# EAGLE design MAX30101_Qwiic_PCB (EAGLE 9.6.2)
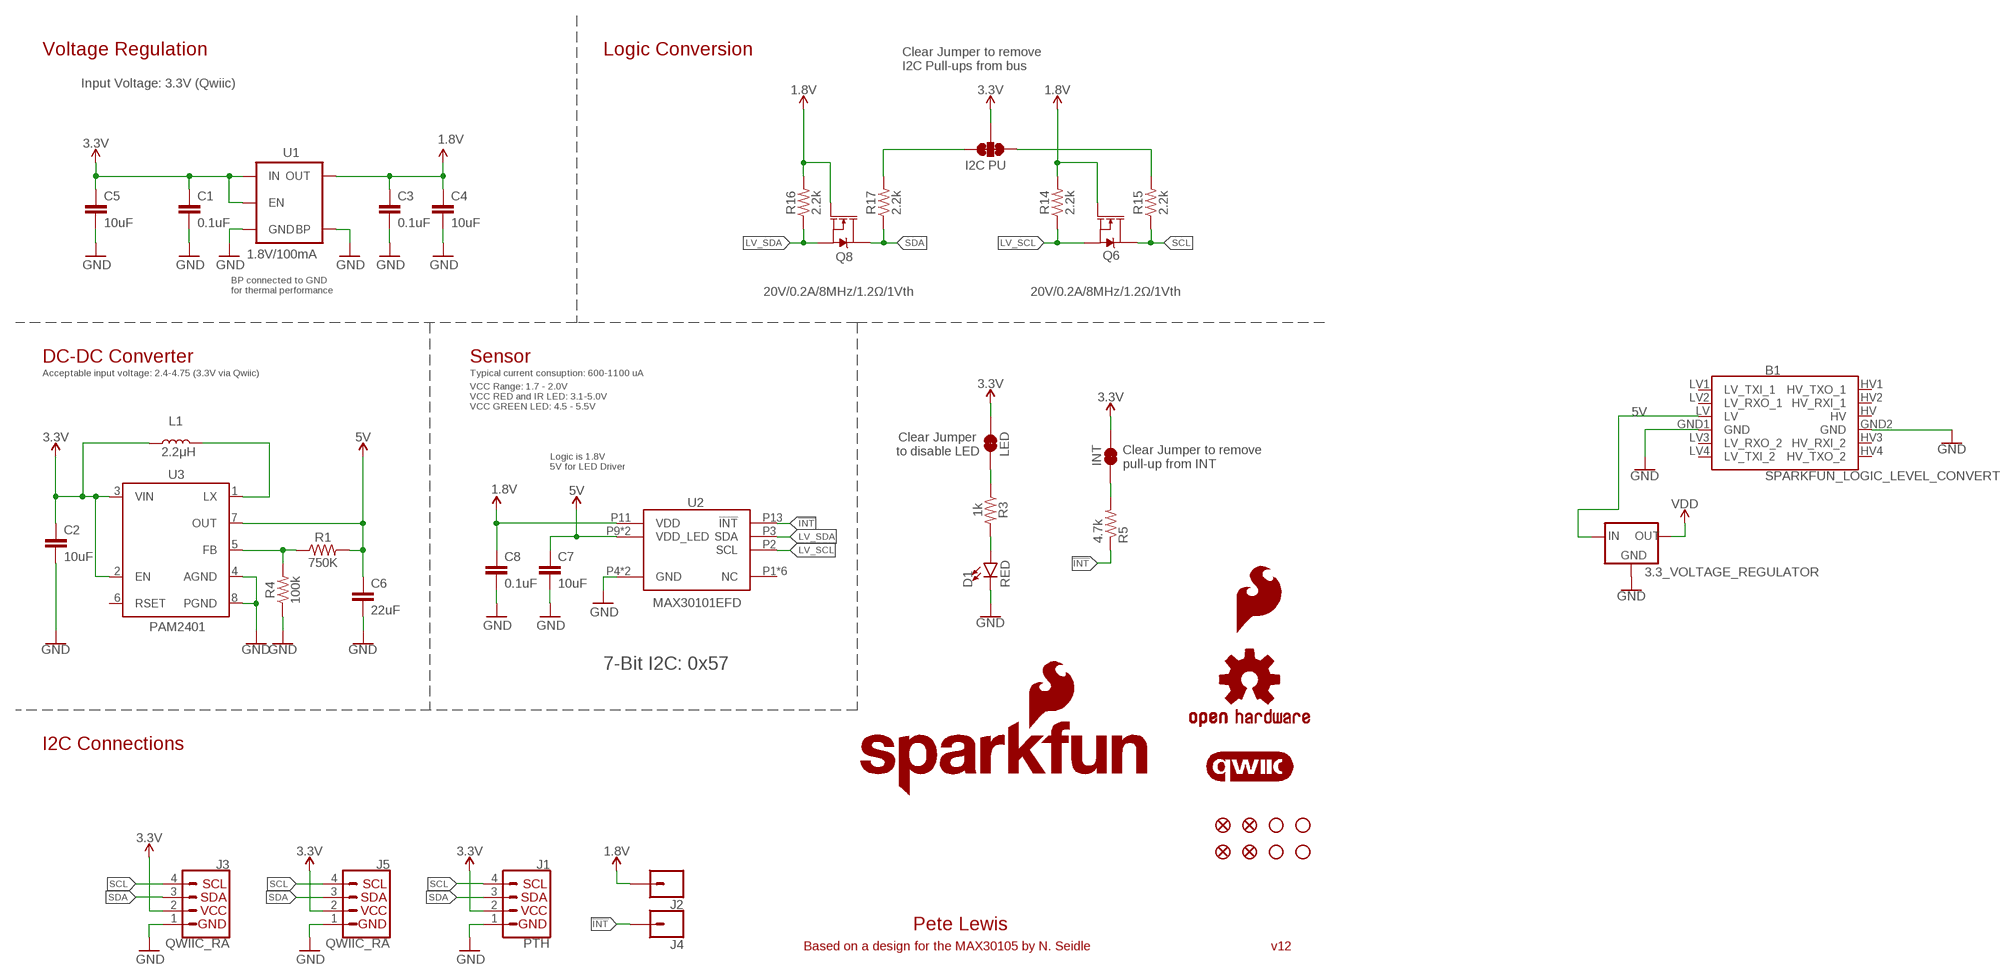
[diagram p0: schematic, sheet 1]

## Parts
3.3_VOLTAGE_REGULATOR  V_REG_78XX-TO-220  [TO-220-ALT]
B1  SPARKFUN_LOGIC_LEVEL_CONVERTER  [SPARKFUN_LOGIC_LEVEL_CONVERTER]
C1  0.1uF  0.1UF-0402-16V-10%  [0402]
C2  10uF  10UF-0603-6.3V-20%  [0603]
C3  0.1uF  0.1UF-0402-16V-10%  [0402]
C4  10uF  10UF-0603-6.3V-20%  [0603]
C5  10uF  10UF-0603-6.3V-20%  [0603]
C6  22uF  22UF-0805-6.3V-20%  [0805]
C7  10uF  10UF-0603-6.3V-20%  [0603]
C8  0.1uF  0.1UF-0402-16V-10%  [0402]
D1  RED  LED-RED0603  [LED-0603]
FID1  FIDUCIAL1X2  [FIDUCIAL-1X2]
FID2  FIDUCIAL1X2  [FIDUCIAL-1X2]
FID3  FIDUCIAL1X2  [FIDUCIAL-1X2]
FID4  FIDUCIAL1X2  [FIDUCIAL-1X2]
J1  PTH  I2C_STANDARD_NO_SILK  [1X04_NO_SILK]
J2  CONN_01PTH_NO_SILK_YES_STOP  [1X01_NO_SILK]
J3  QWIIC_RA  QWIIC_CONNECTORJS-1MM  [JST04_1MM_RA]
J4  CONN_01PTH_NO_SILK_YES_STOP  [1X01_NO_SILK]
J5  QWIIC_RA  QWIIC_CONNECTORJS-1MM  [JST04_1MM_RA]
JP1  LED  JUMPER-SMT_2_NC_TRACE_SILK  [SMT-JUMPER_2_NC_TRACE_SILK]
JP2  INT  JUMPER-SMT_2_NC_TRACE_SILK  [SMT-JUMPER_2_NC_TRACE_SILK]
JP4  I2C PU  JUMPER-SMT_3_2-NC_TRACE_SILK  [SMT-JUMPER_3_2-NC_TRACE_SILK]
L1  2.2μH  2.2μH_SHIELDED_INDUCTOR  [0806]
LOGO1  SFE_LOGO_NAME_FLAME.1_INCH  [SFE_LOGO_NAME_FLAME_.1]
LOGO2  OSHW-LOGOS  [OSHW-LOGO-S]
LOGO3  QWIIC_LOGO_5MM  [QWIIC_5MM]
LOGO4  SFE_LOGO_FLAME.1_INCH  [SFE_LOGO_FLAME_.1]
Q6  20V/0.2A/8MHz/1.2Ω/1Vth  MOSFET-NCH-RE1C00UNTL  [SOT-416FL]
Q8  20V/0.2A/8MHz/1.2Ω/1Vth  MOSFET-NCH-RE1C00UNTL  [SOT-416FL]
R1  750K  750KOHM-0603-1/10W-1%  [0603]
R3  1k  1KOHM-0603-1/10W-1%  [0603]
R4  100k  100KOHM-0603-1/10W-1%  [0603]
R5  4.7k  4.7KOHM-0603-1/10W-1%  [0603]
R14  2.2k  2.2KOHM-0603-1/10W-1%  [0603]
R15  2.2k  2.2KOHM-0603-1/10W-1%  [0603]
R16  2.2k  2.2KOHM-0603-1/10W-1%  [0603]
R17  2.2k  2.2KOHM-0603-1/10W-1%  [0603]
STANDOFF1  STAND-OFF  [STAND-OFF]
STANDOFF2  STAND-OFF  [STAND-OFF]
STANDOFF3  STAND-OFF  [STAND-OFF]
STANDOFF4  STAND-OFF  [STAND-OFF]
U1  1.8V/100mA  V_REG_SP62141.8V  [SC70]
U2  MAX30101EFD  [14_PIN_OESIP]
U3  PAM2401  [MSOP8]

## Nets
1.8V: C3.1 C4.1 C8.1 J2.1 Q6.1(G) Q8.1(G) R14.2 R16.2 U1.5(OUT) U2.P11(VDD)
3.3V: C1.1 C2.1 C5.1 J1.2 J3.2 J5.2 JP1.2 JP2.2 JP4.2 L1.1 U1.1(IN) U1.3(EN) U3.2(EN) U3.3(VIN)
5V: C6.1 C7.1 R1.2 U2.P9(VDD_LED) U2.P10(VDD_LED) U3.7(OUT)
!INT: J4.1 R5.1 U2.P13(!INT)
GND [power]: 3.3_VOLTAGE_REGULATOR.GND B1.GND1(GND) B1.GND2(GND) C1.2 C2.2 C3.2 C4.2 C5.2 C6.2 C7.2 C8.2 D1.C J1.1 J3.1 J5.1 R4.1 U1.2(GND) U1.4(BP) U2.P4(GND) U2.P12(GND) U3.4(AGND) U3.8(PGND)
LV_SCL: Q6.2(S) R14.1 U2.P2(SCL)
LV_SDA: Q8.2(S) R16.1 U2.P3(SDA)
N$1: JP2.1 R5.2
N$2: R1.1 R4.2 U3.5(FB)
N$3: L1.2 U3.1(LX)
N$4: D1.A R3.2
N$5: JP4.3 R15.2
N$6: JP4.1 R17.2
N$7: 3.3_VOLTAGE_REGULATOR.IN B1.LV
N$8: JP1.1 R3.1
SCL: J1.4 J3.4 J5.4 Q6.3(D) R15.1
SDA: J1.3 J3.3 J5.3 Q8.3(D) R17.1
VDD: 3.3_VOLTAGE_REGULATOR.OUT
Unconnected: B1.HV1(HV_TXO_1) B1.HV2(HV_RXI_1) B1.HV3(HV_RXI_2) B1.HV4(HV_TXO_2) B1.LV1(LV_TXI_1) B1.LV2(LV_RXO_1) B1.LV3(LV_RXO_2) B1.LV4(LV_TXI_2) U2.P1(NC) U2.P5(NC) U2.P6(NC) U2.P7(NC) U2.P8(NC) U2.P14(NC) U3.6(RSET)

## Notes on the sheet
- Voltage Regulation | Logic Conversion
- Clear Jumper to remove 
  I2C Pull-ups from bus
- Input Voltage: 3.3V (Qwiic)
- BP connected to GND
  for thermal performance
- DC-DC Converter | Sensor
- Acceptable input voltage: 2.4-4.75 (3.3V via Qwiic) | Typical current consuption: 600-1100 uA
- VCC Range: 1.7 - 2.0V
  VCC RED and IR LED: 3.1-5.0V
  VCC GREEN LED: 4.5 - 5.5V
- Clear Jumper 
  to disable LED
- Clear Jumper to remove 
  pull-up from INT
- Logic is 1.8V
  5V for LED Driver
- 7-Bit I2C: 0x57
- I2C Connections
- Pete Lewis
- Based on a design for the MAX30105 by N. Seidle | v12

## Power pins joined to a net without a drawn wire
HV: B1.HV

## Library data of the parts
3.3_VOLTAGE_REGULATOR = SparkFun-IC-Power:V_REG_78XX: Voltage Regulator Standard 78xx regulator. IGO (Input Ground Output). Spark Fun Electronics SKU : COM-00107; PROD_ID: VREG-08450; SF_ID: COM-00107
B1 = SparkFun-Boards:SPARKFUN_LOGIC_LEVEL_CONVERTER: SparkFun Logic Level Converter -Bi-Directional This is the mechnical outline for the 3.3V - 5V bi directional logic level converter. *Note, the "LOCK" Package has the header pins staggered by an offset of 5 mils (off center line), so that when you slide a row of standard 0.1" headers into the PTH pads, it will hold position vertically. See the follwing turorial for more information on this type of special footprints: Sneaky Footprints <https://www.sparkfun.com/tutorials/114> SparkFun Products: SparkFun Logic Level Converter - Bi-Directional <https://www.sparkfun.com/products/12009>
C1 C3 C8 = SparkFun-Capacitors:0.1UF: 0.1µF ceramic capacitors A capacitor is a passive two-terminal electrical component used to store electrical energy temporarily in an electric field.; PROD_ID: CAP-12416
C2 C4 C5 C7 = SparkFun-Capacitors:10UF: 10.0µF ceramic capacitors A capacitor is a passive two-terminal electrical component used to store electrical energy temporarily in an electric field.; PROD_ID: CAP-11015
C6 = SparkFun-Capacitors:22UF: 22µF ceramic capacitors A capacitor is a passive two-terminal electrical component used to store electrical energy temporarily in an electric field.; PROD_ID: CAP-08402
D1 = SparkFun-LED:LED-RED: Red SMD LED Used in manufacturing of most products at SparkFun Packages: 0603 - SMD 0603 package [Product Link] <http://docs.avagotech.com/docs/AV02-0551EN> 0603 SMART - SMD 0603 SMART package ( more efficient and expensive)[Product Link] <http://www.osram-os.com/Graphics/XPic2/00077099_0.pdf> 1206 - SMD1206 package [Product Link] <https://www.sparkfun.com/datasheets/DevTools/LilyPad/Q150OVS4.pdff> SparkFun Products: Pro Mini 328 -5V <https://www.sparkfun.com/products/821> RedBoard <https://www.sparkfun.com/products/12757> IOIO-OTG <https://www.sparkfun.com/products/13613>; PROD_ID: DIO-00819
FID1-FID4 = SparkFun-Aesthetics:FIDUCIAL: Fiducial Alignment Points Point-of-reference for pick-and-place machines and other optical instruments.
J1 = SparkFun-Connectors:I2C_STANDARD: SparkFun I2C Standard Pinout Header SparkFun has standardized on a pinout for all I2C based sensor breakouts. This pinout allows I2C boards to be plugged directly into the headers on Arduino Uno compatible boards, and to be daisy chained easily. Example SparkFun Products: SparkFun Atmospheric Sensor Breakout - BME280 <https://www.sparkfun.com/products/13676> SparkFun Altitude/Pressure Sensor Breakout - MPL3115A2 <https://www.sparkfun.com/products/11084> SparkFun TOF Range Finder Sensor - VL6180 <https://www.sparkfun.com/products/12785>
J2 J4 = SparkFun-Connectors:CONN_01: Single connection point. Often used as Generic Header-pin footprint for 0.1 inch spaced/style header connections On any of the 0.1 inch spaced packages, you can populate with these: Break Away Headers - Straight <https://www.sparkfun.com/products/116> (PRT-00116) Break Away Male Headers - Right Angle <https://www.sparkfun.com/products/553> (PRT-00553) Female Headers <https://www.sparkfun.com/products/115> (PRT-00115) Break Away Headers - Machine Pin <https://www.sparkfun.com/products/117> (PRT-00117) Break Away Female Headers - Swiss Machine Pin <https://www.sparkfun.com/products/743> (PRT-00743) This device is also useful as a general connection point to wire up your design to another part of your project. Our various solder wires solder well into these plated through hole pads. Hook-Up Wire - Assortment (Stranded, 22 AWG) <https://www.sparkfun.com/products/11375> (PRT-11375) Hook-Up Wire - Assortment (Solid Core, 22 AWG) <https://www.sparkfun.com/products/11367> (PRT-11367) View the entire wire category on our website here <https://www.sparkfun.com/categories/141> Special notes: SMTSO-256-ET is a "flush mount" nut for a 4-40 screw. We mostly use this on specialty testbeds; it is a nice way to connect hardware to your PCB at an adjustable hieght. Also note, the SNAP packages are for using a snappable style connector. We sell a baggie of snaps and they are also used on two LilyPad designs: Snap Assortment - 30 pack (male and female) <https://www.sparkfun.com/products/11347> (DEV-11347) LilyPad Arduino SimpleSnap <https://www.sparkfun.com/products/10941> (DEV-10941) LilyPad SimpleSnap Protoboard <https://www.sparkfun.com/products/10940> (DEV-10940)
J3 J5 = SparkFun-Connectors:QWIIC_CONNECTOR: SparkFun I2C Standard Qwiic Connector An SMD 1mm pitch JST connector makes it easy and quick (get it? Qwiic?) to connect I2C devices to each other. The Qwiic system <http://www.sparkfun.com/qwiic> enables fast and solderless connection between popular platforms and various sensors and actuators. We carry 200mm <https://www.sparkfun.com/products/14204>, 100mm <https://www.sparkfun.com/products/14205>, 50mm <https://www.sparkfun.com/products/14206>, and breadboard friendly <https://www.sparkfun.com/products/14207> Qwiic cables. We also offer 10 pcs strips <https://www.sparkfun.com/products/14323> the SMD connectors.; PROD_ID: CONN-13694; VALUE: QWIIC_RIGHT_ANGLE
JP1 JP2 = SparkFun-Jumpers:JUMPER-SMT_2_NC_TRACE: Normally closed trace jumper This jumper has a trace between two pads so it's normally closed (NC). Use a razor knife to open the connection. For best results follow the IPC guidelines for cutting traces: Cutout at least 0.063 mm (0.005 in). Remove all loose material to clean up the cut area. Seal the cut with an approved epoxy. Reapply solder to reclose the connection.
JP4 = SparkFun-Jumpers:JUMPER-SMT_3_2-NC_TRACE: Normally closed trace jumper (2 of 2 connections) This jumper has a trace between all three pads so they are normally closed (NC). Use a razor knife to open the connection(s). For best results follow the IPC guidelines for cutting traces: Cutout at least 0.063 mm (0.005 in). Remove all loose material to clean up the cut area. Seal the cut with an approved epoxy. Reapply solder to reclose the connection(s).
L1 = SparkFun-Coils:2.2μH_SHIELDED_INDUCTOR: Murata 2.2uH Inductor 2.2uH 1.2A 110mOhm 0806 Package Shielded; PROD_ID: NDUC-14257
LOGO1 = SparkFun-Aesthetics:SFE_LOGO_NAME_FLAME: SparkFun Font Logo w/ Flame This is the SparkFun full logo. The logo on the schematic will always be the same size; the package variant is the height of the flame part of the logo. Default layer for the logo on the board is tSilk.
LOGO2 = SparkFun-Aesthetics:OSHW-LOGO: Open-Source Hardware (OSHW) Logo This logo indicates the piece of hardware it is found on incorporates a OSHW license and/or adheres to the definition of open source hardware found here: http://freedomdefined.org/OSHW
LOGO3 = SparkFun-Aesthetics:QWIIC_LOGO: Qwiic Logos for placement on schematic and PCB. The 5.5mm silk logo is best for placing next to Qwiic connector.
LOGO4 = SparkFun-Aesthetics:SFE_LOGO_FLAME: SparkFun Flame Logo This is the SparkFun flame logo. The logo on the schematic will always be the same size; the package variant is the height of the flame. Default layer for the logo on the board is tSilk.
Q6 Q8 = SparkFun-DiscreteSemi:MOSFET-NCH: N-channel MOSFETs Voltage controlled devices that allow control of high current outputs. SparkFun Products: SparkFun OpenScale <https://www.sparkfun.com/products/13261> SparkFun Digital Sandbox <https://www.sparkfun.com/products/12651> SparkFun Monster Moto Shield <https://www.sparkfun.com/products/10182> SparkFun MOSFET Power Controller <https://www.sparkfun.com/products/11214>; PROD_ID: TRANS-14399
R1 = SparkFun-Resistors:750KOHM: 750Ω resistor A resistor is a passive two-terminal electrical component that implements electrical resistance as a circuit element. Resistors act to reduce current flow, and, at the same time, act to lower voltage levels within circuits. - Wikipedia; PROD_ID: RES-13768
R3 = SparkFun-Resistors:1KOHM: 1kΩ resistor A resistor is a passive two-terminal electrical component that implements electrical resistance as a circuit element. Resistors act to reduce current flow, and, at the same time, act to lower voltage levels within circuits. - Wikipedia; PROD_ID: RES-07856
R4 = SparkFun-Resistors:100KOHM: 100kΩ resistor A resistor is a passive two-terminal electrical component that implements electrical resistance as a circuit element. Resistors act to reduce current flow, and, at the same time, act to lower voltage levels within circuits. - Wikipedia; PROD_ID: RES-07828
R5 = SparkFun-Resistors:4.7KOHM: 4.7kΩ resistor A resistor is a passive two-terminal electrical component that implements electrical resistance as a circuit element. Resistors act to reduce current flow, and, at the same time, act to lower voltage levels within circuits. - Wikipedia; PROD_ID: RES-07857
R14-R17 = SparkFun-Resistors:2.2KOHM: 2.2kΩ resistor A resistor is a passive two-terminal electrical component that implements electrical resistance as a circuit element. Resistors act to reduce current flow, and, at the same time, act to lower voltage levels within circuits. - Wikipedia; PROD_ID: RES-08272
STANDOFF1-STANDOFF4 = SparkFun-Electromechanical:STAND-OFF: #4 Stand Off This is the mechanical footprint for a #4 phillips button head screw. Use the keepout ring to avoid running the screw head into surrounding components. SKU : PRT-00447
U1 = SparkFun-PowerIC:V_REG_SP6214; PROD_ID: VREG-08428
U2 = SparkFun-IC-Special-Function:MAX30101EFD: MAX30101 High-Sensitivity Pulse Oximeter and Heart-Rate Sensor The MAX30101 is an integrated pulse oximetry and heart-rate monitor module. It includes internal LEDs, photodetectors, optical elements, and low-noise electronics with ambient light rejection. The MAX30101 provides a complete system solution to ease the design-in process for mobile and wearable devices. The MAX30101 operates on a single 1.8V power supply and a separate 5.0V power supply for the internal LEDs. Communication is through a standard I2C-compatible interface. The module can be shut down through software with zero standby current, allowing the power rails to remain powered at all times; PROD_ID: IC-14270
U3 = SparkFun-IC-Power:PAM2401: PAM2401 - Boost PMIC Specifications: Up to 1A output current 0.9V to 4.75V Input Range 2.5V to 5.0V Adjustable Output Voltage Datasheet <https://www.diodes.com/assets/Datasheets/PAM2401.pdf> (Diodes inc.); PROD_ID: IC-13769

## Net classes
1 power: width 0.203 mm

## Board
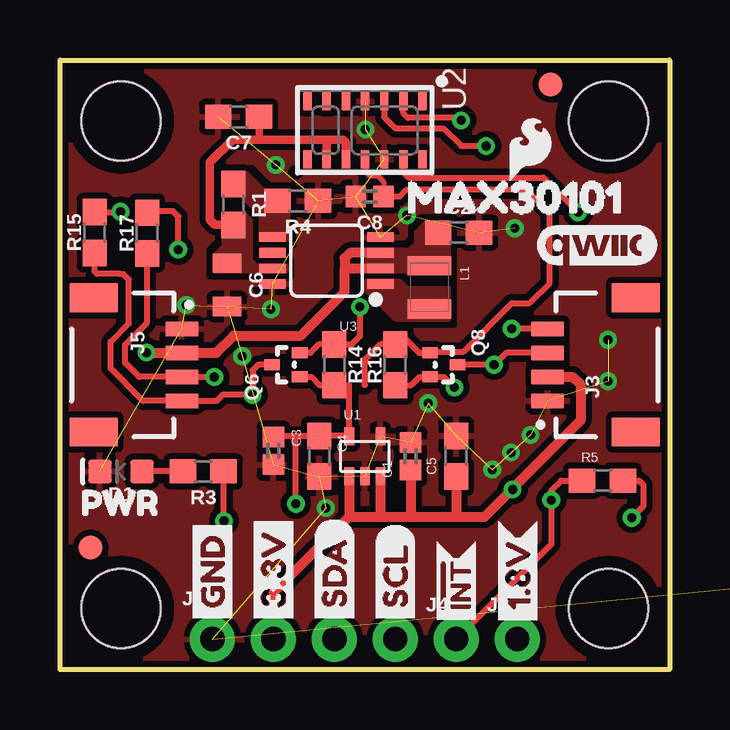
[diagram p1: board, top side]
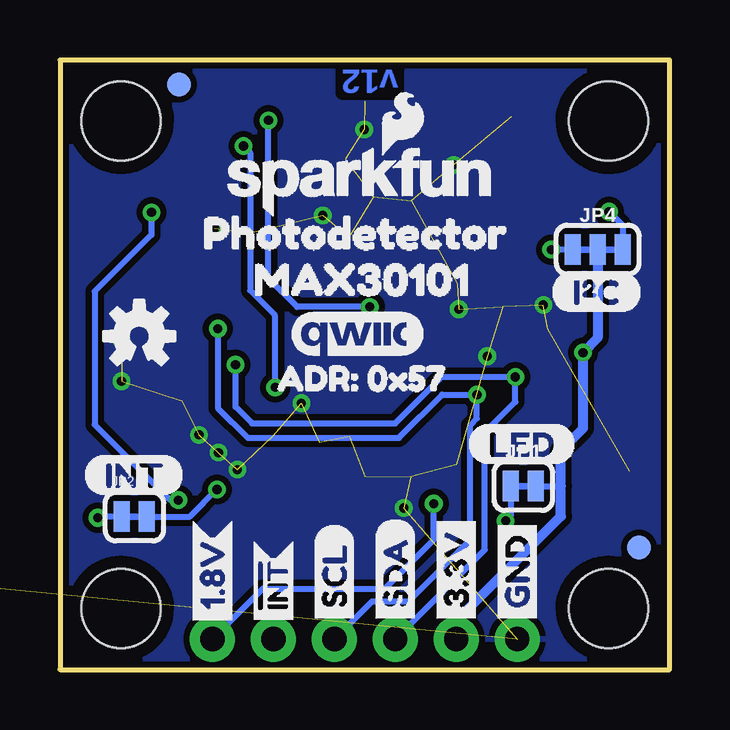
[diagram p2: board, bottom side, seen from below]

Size 25.4 x 25.4 mm. Coordinates in mm from the lower left corner, seen from the top.
Outline: 25.4,25.4 25.4,0 0,0 0,25.4 25.4,25.4
Copper layers (1*16): Top 0.035mm / dielectric 1.5mm / Bottom 0.035mm
Design rules "SparkFun-2-layer-TIGHT": minimum track width 7mil, minimum drill 15mil, track to track 7mil, track to pad 7mil, pad to pad 7mil, via to via 7mil, smd to smd 7mil, copper to edge 7mil, drill to drill 7mil, minimum pad ring 7mil, minimum via ring 7mil, stop-mask expansion 4mil, vias tented up to drill 25mil, thermal gap 10mil

### Footprints (pad centres in the part's own frame; a part is rotated, then mirrored left to right if it is on the bottom)
TO-220-ALT = drill 1.016 long: GND 0,-3.81; IN -2.54,-3.81; OUT 2.54,-3.81 | hole 3.302: 0,11.176
SPARKFUN_LOGIC_LEVEL_CONVERTER = drill 1.016 pad 1.88: GND1 -5.08,-1.27; GND2 5.08,-1.27; HV 5.08,1.27; HV1 5.08,6.35; HV2 5.08,3.81; HV3 5.08,-3.81; HV4 5.08,-6.35; LV -5.08,1.27; LV1 -5.08,6.35; LV2 -5.08,3.81; LV3 -5.08,-3.81; LV4 -5.08,-6.35
0402 = smd 0.85 x 0.9: 1 -0.58,0; 2 0.58,0
0603 = smd 1.1 x 1: 1 -0.85,0; 2 0.85,0
0805 = smd 0.8 x 1.2: 1 -0.9,0; 2 0.9,0
LED-0603 = smd 1 x 1: A -0.877,0; C 0.877,0
FIDUCIAL-1X2 = smd 1 x 1: 1 0,0
1X04_NO_SILK = drill 1.016 pad 1.88: 1 0,0; 2 2.54,0; 3 5.08,0; 4 7.62,0
1X01_NO_SILK = drill 1.016 pad 1.88: 1 0,0
JST04_1MM_RA = smd 0.6 x 1.35: 1 -1.5,0; 2 -0.5,0; 3 0.5,0; 4 1.5,0 | smd 1.2 x 2: NC1 2.8,-3.675; NC2 -2.8,-3.675
SMT-JUMPER_2_NC_TRACE_SILK = smd 0.66 x 1.27: 1 -0.521,0; 2 0.521,0
SMT-JUMPER_3_2-NC_TRACE_SILK = smd 0.66 x 1.27: 1 -1.041,0; 2 0,0; 3 1.041,0
0806 = smd 0.8 x 1.8: 1 -0.9,0; 2 0.9,0
SOT-416FL = smd 0.46 x 0.65: 1 -0.5,-1.1; 2 0.5,-1.1; 3 0,0.05
STAND-OFF = hole 3.302: 0,0
SC70 = smd 0.4 x 0.75: 1 -0.65,-0.825; 2 0,-0.825; 3 0.65,-0.825; 4 0.65,0.825; 5 -0.65,0.825
14_PIN_OESIP = smd 0.75 x 0.35: P1 -1.193,2.409; P2 -1.193,1.609; P3 -1.193,0.809; P4 -1.193,0.009; P5 -1.193,-0.791; P6 -1.193,-1.591; P7 -1.193,-2.391; P8 1.207,-2.391; P9 1.207,-1.591; P10 1.207,-0.791; P11 1.207,0.009; P12 1.207,0.809; P13 1.207,1.609; P14 1.207,2.409
MSOP8 = smd 0.4 x 1.1: 1 -0.975,-2.25; 2 -0.325,-2.25; 3 0.325,-2.25; 4 0.975,-2.25; 5 0.975,2.25; 6 0.325,2.25; 7 -0.325,2.25; 8 -0.975,2.25

### Placement (x,y rotation side)
3.3_VOLTAGE_REGULATOR  58.42,10.16 0 top  (outside the outline)
B1  78.74,20.32 0 top  (outside the outline)
C1  14.61,8.89 90 top
C2  16.61,18.21 0 top
C3  8.89,9.12 270 top
C4  10.79,8.89 270 top
C5  16.51,8.89 90 top
C6  6.96,16.03 270 top
C7  7.44,23.04 180 top
C8  12.9,19.71 180 top
D1  2.54,8.26 180 top
FID1  20.45,24.38 90 top
FID2  1.27,5.08 90 top
FID3  20.45,24.38 0 bottom
FID4  1.27,5.08 0 bottom
J1  6.35,1.27 0 top
J2  19.05,1.27 0 top
J3  20.32,12.7 90 top
J4  16.51,1.27 0 top
J5  5.08,12.7 270 top
JP1  6.1,7.65 0 bottom
JP2  22.3,6.38 0 bottom
JP4  3,17.5 0 bottom
L1  15.39,15.93 270 top
LOGO1  12.85,20.35 0 bottom
LOGO2  22.1,13.89 0 bottom
LOGO3  22.35,17.7 0 top
LOGO4  19.58,21.69 0 top
Q6  8.89,12.7 90 top
Q8  16.51,12.7 270 top
R1  7.21,19.38 270 top
R3  5.97,8.26 180 top
R4  9.91,19.53 180 top
R5  22.61,7.87 0 top
R14  11.43,12.7 270 top
R15  1.45,18.21 90 top
R16  13.97,12.7 90 top
R17  3.63,18.19 90 top
STANDOFF1  2.54,22.86 90 top
STANDOFF2  22.86,22.86 90 top
STANDOFF3  22.86,2.54 90 top
STANDOFF4  2.54,2.54 90 top
U1  12.7,8.89 0 top
U2  12.7,22.48 270 top
U3  11.1,17.04 90 top
U$1  [PHOTODETECTOR3]  20.6,18.19 0 bottom
U$3  [INT#-[<-04]  16.51,1.4 90 top
U$4  [MAX301010]  13.31,19.68 0 top
U$7  [INT-()-04]  24.46,8.1 0 bottom
U$8  [LED0]  8.46,9.4 0 bottom
U$9  [SCL-[)]  13.97,1.65 90 bottom
U$10  [GND-04]  6.35,1.65 90 top
U$11  [INT#-[<-04]  16.51,1.4 90 bottom
U$12  [SCL-[)]  13.97,1.65 90 top
U$13  [SDA-[)]  11.43,1.65 90 top
U$14  [SDA-[)]  11.43,1.65 90 bottom
U$15  [ADR#_0X570]  17.22,12.14 0 bottom
U$16  [QWIIC_5.5MM]  13,14 0 bottom
U$19  [3.3V]  8.89,1.65 90 top
U$20  [1#8V0]  19.08,1.57 90 top
U$21  [I_SUPER2_C-()-04]  4.95,15.72 0 bottom
U$22  [3.3V]  8.89,1.65 90 bottom
U$23  [GND-04]  6.35,1.65 90 bottom
U$24  [MAX301010]  18.47,16.26 0 bottom
U$26  [PWR_TO]  -0.03,6.96 0 top
U$27  [1#8V0]  19.05,1.57 90 bottom

### Tracks (layer width: path | path; a pad name or v marks a point on that pad's centre or on a via)
1.8V  (via drill 0.38)
  Top 0.203: U2.P11 12.71,20.77 12.9,20.57 13.23,20.57 13.48,20.32 C8.1
  Top 0.254: 12.69,11.85 12.7,11.86 12.7,12.9 13.35,13.55 R16.2 14.29,13.87 14.97,13.2 Q8.1 15.46,13.25 16.82,13.25 18.83,15.27 19.56,15.27 20.4,16.1 20.4,19.02 19.43,19.99 14.43,19.99 14.15,19.71 C8.1 | Q6.1 10.48,12.2 10.83,11.85 R14.2 12.05,11.85 U1.5 12.03,9.74 C4.1 9.83,9.74 | v9.83,6.91 9.83,9.74 | C3.1 8.93,9.74 9.83,9.74
  Bottom 0.254: J2.1 16.94,3.38 11.86,3.38 9.83,5.41 v9.83,6.91
3.3V  (via drill 0.38)
  Top 0.406: J3.2 21.35,12.2 21.69,11.86 21.69,10.39 18.86,7.56 v18.86,7.51 18.83,7.51 17.68,6.35 16.51,6.35 | 16.51,6.35 14.61,6.35 | 14.61,6.35 13.34,6.35 | U1.3 13.35,6.37 13.34,6.35 | C1.1 14.61,6.35 | C5.1 16.51,6.35 | J1.2 8.89,3.2 12.04,6.35 | 13.34,6.35 12.04,6.35 | U1.1 12.05,6.36 12.04,6.35 | v3.61,13.21 J5.2 6.52,13.2 7.24,13.92 10.03,13.92 11.86,15.75 11.86,16.66 | 11.86,16.66 11.92,16.72 U3.2 | U3.3 12.09,17.37 11.86,17.14 11.86,16.66
  Bottom 0.254: JP2.2 19.99,6.38 v18.86,7.51 | JP1.2 4.53,7.64
  Bottom 0.406: J1.2 8.89,2.03 4.53,6.39 4.53,7.64 4.53,9.13 3.61,10.06 v3.61,13.21 3,13.82 JP4.2
  pour Top (no thermals): 16.21,18.62 15.24,18.62 14.83,18.21 14.83,17.73 14.58,17.48 12.78,17.48 12.78,16.61 14.45,16.61 14.53,16.54 16.21,16.54
5V
  Top 0.305: C7.1 8.29,22.08 8.28,22.07
  Top 0.356: 11.1,22.07 11.81,22.07 11.91,21.98 U2.P10 | 11.1,22.07 8.28,22.07 7.19,22.07 6.25,21.13 6.25,18.75 6.45,18.54 7.2,18.54 R1.2 | U2.P9 11.11,22.06 11.1,22.07
  pour Top (no thermals): 9.42,16.81 8.18,16.81 7.95,17.04 7.95,18.69 7.67,18.97 6.83,18.97 6.83,17.63 6.45,17.25 6.45,16.61 9.42,16.61
!INT  (via drill 0.38)
  Top 0.254: v21.59,19.05 20.14,20.5 14.53,20.5 14.32,20.7 14.31,20.72 U2.P13 | R5.1 20.88,7.87 20.47,7.47 v20.47,7.06 20.47,5.23 J4.1
  Bottom 0.254: v21.59,19.05 21.59,18.12 23.95,15.75 23.95,10.21 20.8,7.06 v20.47,7.06
GND  (via drill 0.38)  (35 unrouted)
  other vias: 11.07,6.73 15.34,11.1 18.01,8.33 19.61,9.78 5.26,15.19 12.73,22.5 7.59,13.06 18.8,9.04 22.83,13.74 22.83,12.01 14.45,18.92 18.95,18.39 8.79,15.01 8.99,21.03
  pour Top (isolate 0.254, rank 6): 0,25.4 0,0 25.4,0 25.4,25.4
  pour Bottom (isolate 0.254, rank 6): 0,25.4 0,0 25.4,0 25.4,25.4
LV_SCL  (via drill 0.38)
  Top 0.254: Q6.2 10.43,13.2 10.78,13.55 R14.1 12.17,13.55 12.5,13.88 v12.5,15.11 | v16.71,22.89 16.61,22.99 14.5,22.99 14.31,23.18 U2.P2
  Bottom 0.254: v12.5,15.11 15.52,15.11 16.71,16.31 v16.71,22.89
LV_SDA  (via drill 0.38)
  Top 0.254: R16.1 14.64,11.85 14.99,12.2 Q8.2 15.99,12.2 v16.43,11.76 | v17.75,21.82 16.71,21.82 15.98,22.55 13.97,22.55 13.51,23.02 U2.P3
  Bottom 0.254: v16.43,11.76 16.43,14.76 17.48,15.8 17.48,21.54 v17.75,21.82
N$1  (via drill 0.38)
  Top 0.254: R5.2 24.13,7.87 24.31,7.7 24.31,6.81 v23.82,6.33
  Bottom 0.254: JP2.1 23.77,6.38 v23.82,6.33
N$2
  pour Top (no thermals): 8.38,17.91 8.38,18.95 7.54,19.79 6.83,19.79 6.83,20.68 7.75,20.68 8.51,19.91 9.5,19.91 9.5,17.91
N$3
  pour Top (no thermals): 16.21,14.61 16.21,15.88 15.88,15.88 14.45,15.88 14.15,16.18 12.73,16.18 12.73,15.88 14,14.61
N$4
  Top 0.254: R3.2 D1.A
N$5  (via drill 0.38)
  Top 0.254: R15.2 2.51,19.06 v2.52,19.07
  Bottom 0.254: v2.52,19.07 1.96,18.51 JP4.3
N$6  (via drill 0.38)
  Top 0.254: v4.93,17.5 4.93,18.87 4.7,19.1 3.7,19.1 R17.2
  Bottom 0.254: JP4.1 v4.93,17.5
N$7  (1 unrouted)
N$8  (via drill 0.38)
  Top 0.254: v6.83,6.2 6.82,6.21 R3.1
  Bottom 0.254: JP1.1 6.62,6.41 v6.83,6.2
SCL  (via drill 0.38)
  Top 0.254: R15.1 1.45,16.59 1.55,16.48 2.51,16.48 2.64,16.48 2.87,16.25 2.87,14.43 2.11,13.66 2.11,12.55 3.46,11.2 J5.4 6.53,11.2 6.78,11.46 v8.03,11.46 8.03,12.47 8.26,12.7 Q6.3 | J3.4 v18.82,14.2
  Bottom 0.254: v18.82,14.2 18.82,10.9 17.58,9.65 11.28,9.65 9.47,11.46 v8.03,11.46 8.03,10.46 8.31,10.19 8.31,5.41 10.87,2.85 12.39,2.85 J1.4
SDA  (via drill 0.38)
  Top 0.254: R17.1 3.61,17.31 3.61,14.43 2.72,13.54 2.72,12.78 3.29,12.2 J5.3 6.42,12.2 v6.43,12.19 | J3.3 18.59,13.2 v18.09,12.7 Q8.3
  Bottom 0.254: v18.09,12.7 18.09,10.95 17.4,10.26 11.43,10.26 9.5,12.19 v6.43,12.19 6.43,11.15 7.7,9.88 7.7,5 J1.3
(copper drawn outside any net)
  shapes: Top area x3

### Text on the board
Bottom: v12